# Altium schematic sheet Interface - EEPROM.SchDoc
size A; SheetNumber: 11; SheetTotal: 11
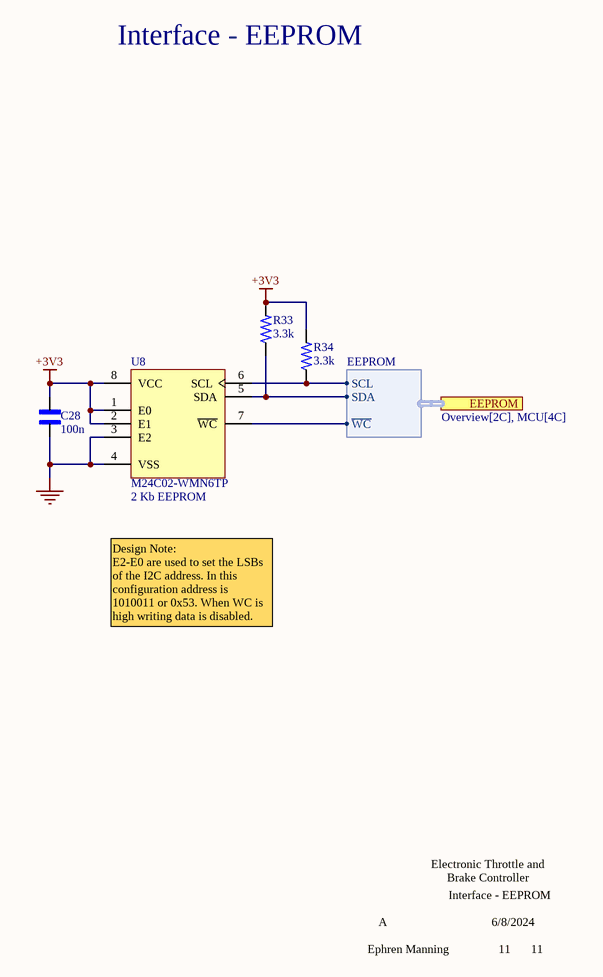
[diagram p0: Interface - EEPROM.SchDoc]

## Parts
C28  100n  [CAP_0402-Footprint-1]
R33  3.3k  [RES_0402-Footprint-1]
R34  3.3k  [RES_0402-Footprint-1]
U8  M24C02-WMN6TP  [FP-SO8N-SO-A-IPC_B]

## Ports
EEPROM (harness EEPROM, see Overview[2C], MCU[4C])

## Harnesses
EEPROM: SCL, SDA, ~{WC}

## Nets
+3V3: C28.2 R33.2 R34.2 U8.1(E0) U8.2(E1) U8.8(VCC)
GND: C28.1 U8.3(E2) U8.4(VSS)
NetR33_1: R33.1 U8.5(SDA) ; port EEPROM.SDA
NetR34_1: R34.1 U8.6(SCL) ; port EEPROM.SCL
NetU8_7: U8.7(~{WC}) ; port EEPROM.~{WC}

## Notes on the sheet
- Interface - EEPROM
- (near U8) 2 Kb EEPROM
- Design Note:
  E2-E0 are used to set the LSBs of the I2C address. In this configuration address is 1010011 or 0x53. When WC is high writing data is disabled.
- Electronic Throttle and
  Brake Controller
- A
- 6/8/2024
- Ephren Manning
- 11
- Project Title:
- Sheet Title:
- Revision:
- Date:
- Author:
- Sheet        of

## Library data of the parts
C28 = CMP-00066-3: 100nF 10V 10% 0402 CAP; Manufacturer Part Number 1: CL05B104KP5NNNC; Manufacturer 1: Samsung Electro-Mechanics; Digikey Part Number: 1276-1002-1-ND
R33 R34 = CMP-00091-1: 3.3k 1% 1/16W 0402 Thick Film; Manufacturer 1: YAGEO; Manufacturer Part Number 1: RC0402FR-073K3L; Digikey Part Number: 311-3.30KLRCT-ND
U8 = CMP-00089-1: 2Kb I2C EEPROM; Manufacturer 1: STMicroelectronics; Manufacturer Part Number 1: M24C02-WMN6TP; Digikey Part Number: 497-8552-1-ND